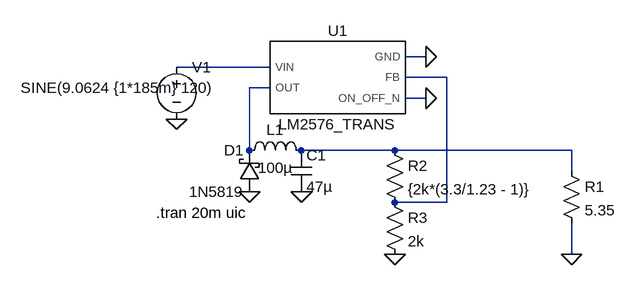
[diagram p0: schematic Buck3v3.asc]
Buck3v3.asc, the LTspice schematic file:
Version 4
SHEET 1 880 680
WIRE 384 48 352 48
WIRE 144 64 0 64
WIRE 416 80 352 80
WIRE 144 96 112 96
WIRE 384 112 352 112
WIRE 112 192 112 96
WIRE 336 192 192 192
WIRE 608 192 336 192
WIRE 608 224 608 192
WIRE 416 272 416 80
WIRE 416 272 336 272
WIRE 608 352 608 304
FLAG 384 48 0
FLAG 384 112 0
FLAG 0 144 0
FLAG 112 256 0
FLAG 192 256 0
FLAG 336 352 0
FLAG 608 352 0
SYMBOL LM2576_TRANS 240 80 R0
SYMATTR InstName U1
SYMBOL voltage 0 48 R0
WINDOW 123 0 0 Left 0
WINDOW 39 0 0 Left 0
WINDOW 3 -240 48 Left 2
SYMATTR Value SINE(9.0624 {1*185m} 120)
SYMATTR InstName V1
SYMBOL ind 96 208 R270
WINDOW 0 32 56 VTop 2
WINDOW 3 5 56 VBottom 2
SYMATTR InstName L1
SYMATTR Value 100µ
SYMBOL cap 176 192 R0
SYMATTR InstName C1
SYMATTR Value 47µ
SYMBOL res 592 208 R0
SYMATTR InstName R1
SYMATTR Value 5.35
SYMBOL schottky 128 256 R180
WINDOW 0 24 64 Left 2
WINDOW 3 24 0 Left 2
SYMATTR InstName D1
SYMATTR Value 1N5819
SYMATTR Description Diode
SYMATTR Type diode
SYMBOL res 320 176 R0
SYMATTR InstName R2
SYMATTR Value {2k*(3.3/1.23 - 1)}
SYMBOL res 320 256 R0
SYMATTR InstName R3
SYMATTR Value 2k
TEXT -32 288 Left 2 !.tran 20m uic

The netlist it stands for:
* Buck3v3.asc
XU1 N001 N003 0 N002 0 LM2576_TRANS  ; pins VIN OUT GND FB ON_OFF_N
V1 N001 0 SINE(9.0624 {1*185m} 120)
L1 N003 N004 100µ
C1 N004 0 47µ
R1 N004 0 5.35
D1 0 N003 1N5819
R2 N004 N002 {2k*(3.3/1.23 - 1)}
R3 N002 0 2k
.model D D
.lib standard.dio
.tran 20m uic
.lib C:\users\omar\My Documents\University\IX_Semester\Disenio\Easyrun\Circuit Design\LTspice Simulations\LM2576_TRANS.LIB
.backanno
.end